# Altium schematic sheet PumpControl.SchDoc: Sample Sheet Title
size B; Date: MM/DD/YYYY; Author: Sample Author; Organization: ORGANIZATION; Address1: ADDRESS 1; Address2: ADDRESS 2; Address3: ADDRESS 3; Address4: ADDRESS 4; Revision: -; SheetNumber: 1; SheetTotal: 3; ENG_APP_DATE: --/--/--; DSN_APP_DATE: --/--/--; CHK_APP_DATE: --/--/--
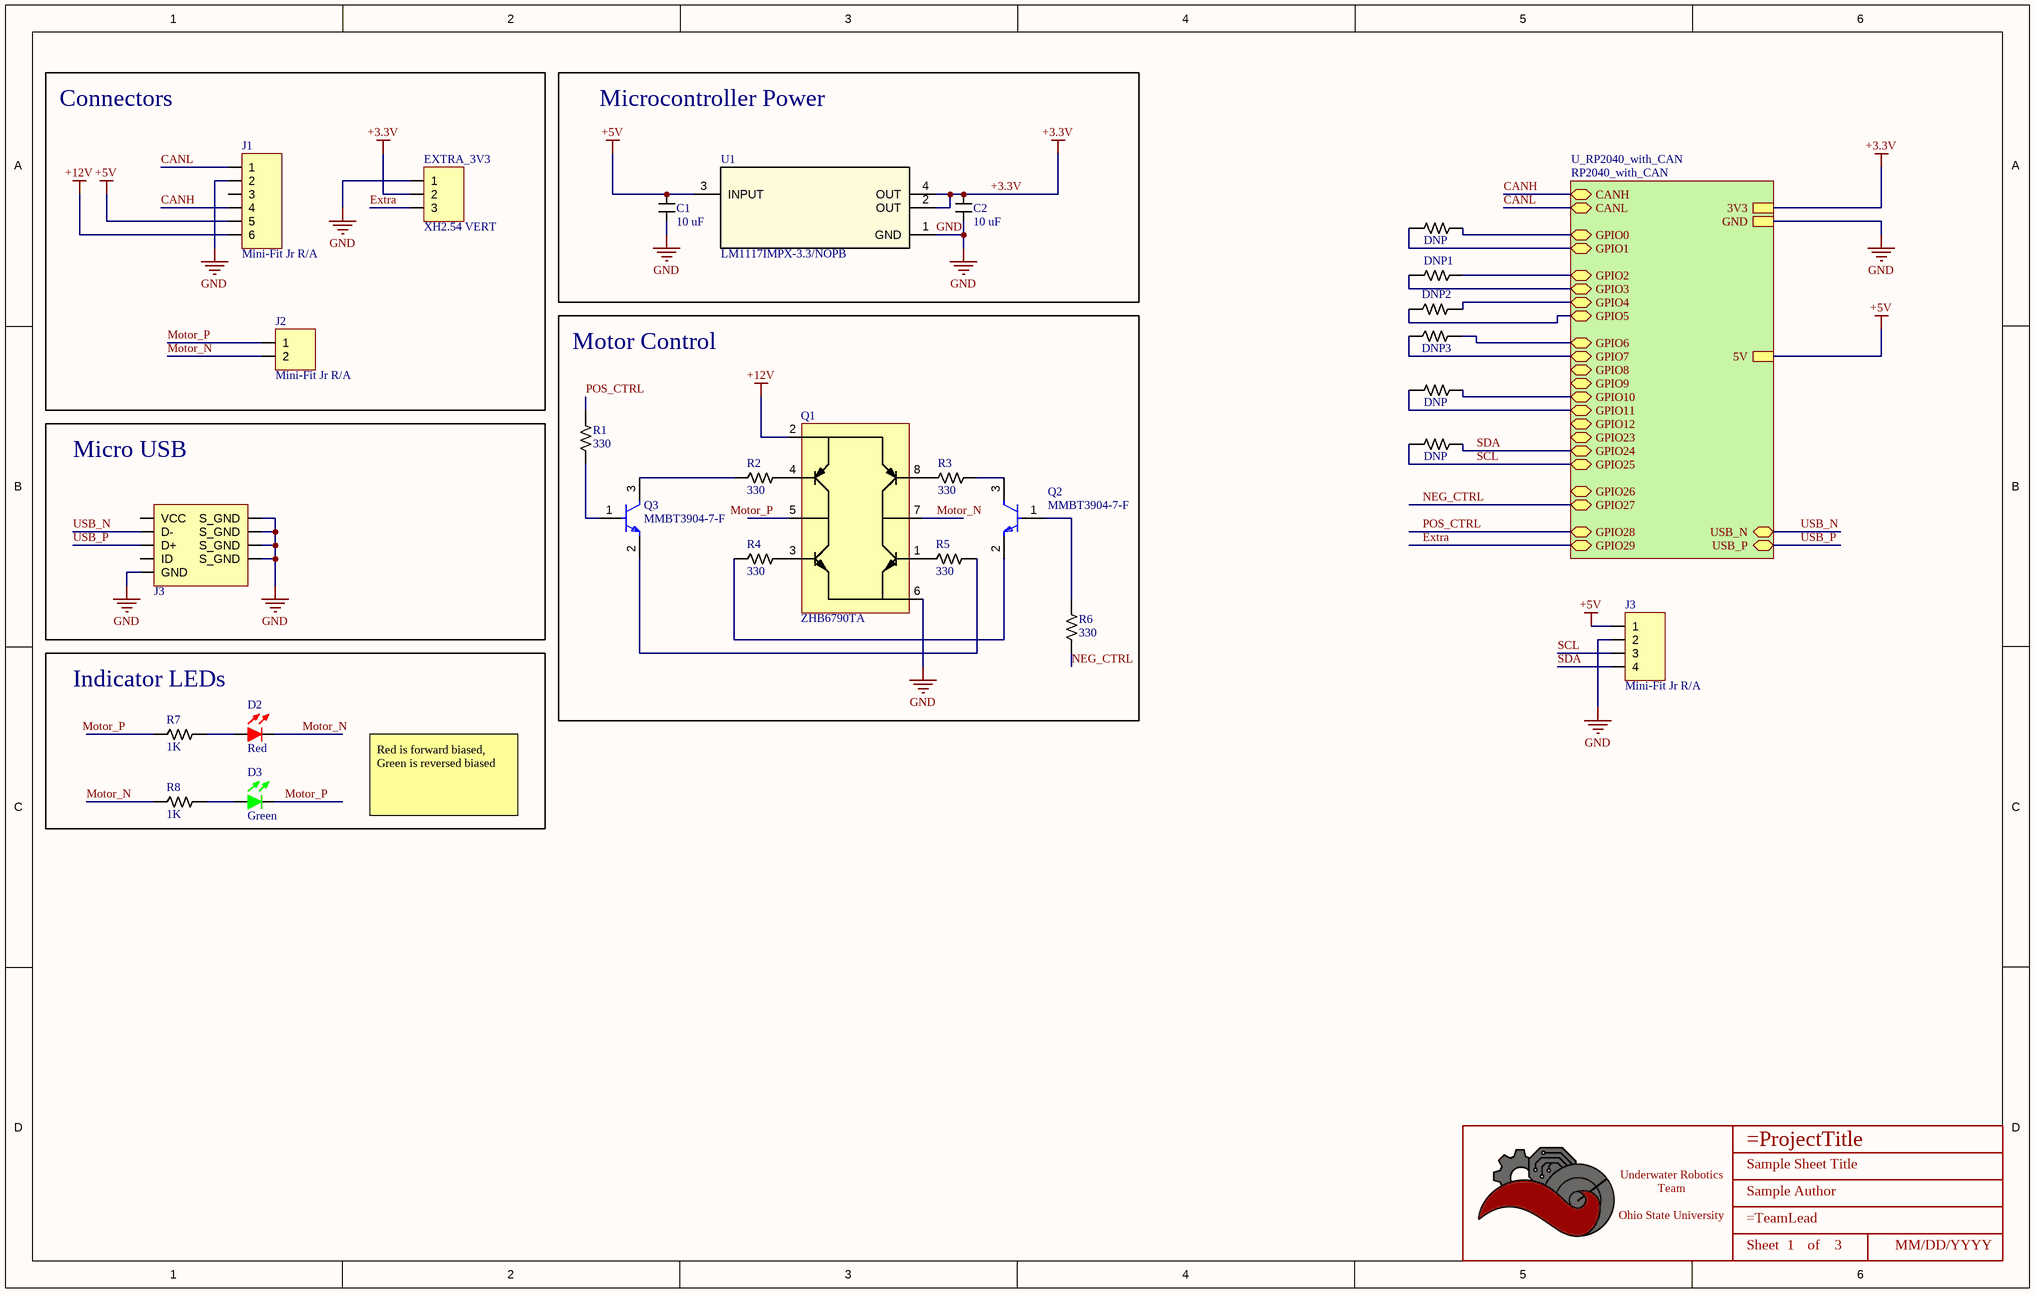
[diagram p0: PumpControl.SchDoc]

## Parts
(Parts that share a designator on the sheet are numbered #1, #2 ... from top to bottom, then left to right.)
*  Title_Block  [LOGO]  (value not drawn)  (graphical)
C1  Value (uF): 10 uF  [CAPACITOR_0603]  (hidden comment: 10uF Ceramic 6.3V)
C2  Value (uF): 10 uF  [CAPACITOR_0603]  (hidden comment: 10uF Ceramic 6.3V)
D2  Color: Red  [LED_0603]  (hidden comment: 150060RS75000)
D3  Color: Green  [LED_0603]  (hidden comment: IN-S63AT5G)
DNP1  DNP  [RESISTOR_0402]  (value not drawn)
DNP2  DNP  [RESISTOR_0402]  (value not drawn)
DNP3  DNP  [RESISTOR_0402]  (value not drawn)
DNP5  DNP  [RESISTOR_0402]
DNP7  DNP  [RESISTOR_0402]
DNP9  DNP  [RESISTOR_0402]
EXTRA_3V3  XH2.54 VERT  [CONN_JST_XH254_3POS_VERT]
J1  Mini-Fit Jr R/A  [CONN_MOLEX_MINIFIT JR_6 POS_R/A]
J2  Mini-Fit Jr R/A  [CONN_MOLEX_MINIFIT JR_2 POS_R/A]
J3#1  USB_MICRO R/A  [CONN_MINIUSB]  (value not drawn)
J3#2  Mini-Fit Jr R/A  [CONN_MOLEX_MINIFIT JR_4 POS_R/A]
Q1  ZHB6790TA  [SOT-223-8]
Q2  MMBT3904-7-F  [FP-SOT23-IPC_A]
Q3  MMBT3904-7-F  [FP-SOT23-IPC_A]
R1  Value  (Ohms): 330  [RESISTOR_0603]  (hidden comment: 330 Ohm 1% 1/10W)
R2  Value  (Ohms): 330  [RESISTOR_0603]  (hidden comment: 330 Ohm 1% 1/10W)
R3  Value  (Ohms): 330  [RESISTOR_0603]  (hidden comment: 330 Ohm 1% 1/10W)
R4  Value  (Ohms): 330  [RESISTOR_0603]  (hidden comment: 330 Ohm 1% 1/10W)
R5  Value  (Ohms): 330  [RESISTOR_0603]  (hidden comment: 330 Ohm 1% 1/10W)
R6  Value  (Ohms): 330  [RESISTOR_0603]  (hidden comment: 330 Ohm 1% 1/10W)
R7  Value  (Ohms): 1K  [RESISTOR_0603]  (hidden comment: 1k Ohm 5% 1/8W)
R8  Value  (Ohms): 1K  [RESISTOR_0603]  (hidden comment: 1k Ohm 5% 1/8W)
U1  LM1117IMPX-3.3/NOPB  [SOT-223-4]

## Blocks framed on the sheet
Connectors: EXTRA_3V3 J1 J2
Microcontroller Power: C1 C2 U1
Motor Control: Q1-Q3 R1-R6
Micro USB: J3#1
Indicator LEDs: D2 D3 R7 R8

## Sub-sheets
U_RP2040_with_CAN = RP2040_with_CAN: USB_P (bidir), USB_N (bidir), 5V, CANH (bidir), CANL (bidir), GPIO0 (bidir), GPIO1 (bidir), GPIO2 (bidir), GPIO3 (bidir), GPIO4 (bidir), GPIO5 (bidir), GPIO6 (bidir), GPIO7 (bidir), GPIO8 (bidir), GPIO9 (bidir), GPIO10 (bidir), GPIO11 (bidir), GPIO12 (bidir), GPIO23 (bidir), GPIO24 (bidir), GPIO25 (bidir), GPIO26 (bidir), GPIO27 (bidir), GPIO28 (bidir), GPIO29 (bidir), 3V3, GND

## Nets
+3.3V: C2.1 EXTRA_3V3.2 U1.2(OUT) U1.4(OUT) ; sheet U_RP2040_with_CAN/3V3
+5V: C1.1 J1.5 J3#2.1 U1.3(INPUT) ; sheet U_RP2040_with_CAN/5V
+12V: J1.6 Q1.2(E1,_E4)
GND: C1.2 C2.2 EXTRA_3V3.1 J1.2 J3#1.5(GND) J3#1.6(S_GND) J3#1.7(S_GND) J3#1.8(S_GND) J3#1.9(S_GND) J3#2.2 Q1.6(E2,_E3) U1.1(GND) ; sheet U_RP2040_with_CAN/GND
CANH: J1.4 ; sheet U_RP2040_with_CAN/CANH
CANL: J1.1 ; sheet U_RP2040_with_CAN/CANL
Extra: EXTRA_3V3.3 ; sheet U_RP2040_with_CAN/GPIO29
Motor_N: D2.2 J2.2 Q1.7(C3,_C4) R8.2
Motor_P: D3.2 J2.1 Q1.5(C1,_C2) R7.2
NEG_CTRL: R6.2 ; sheet U_RP2040_with_CAN/GPIO27
POS_CTRL: R1.1 ; sheet U_RP2040_with_CAN/GPIO28
SCL: DNP7.1 J3#2.3 ; sheet U_RP2040_with_CAN/GPIO25
SDA: DNP7.2 J3#2.4 ; sheet U_RP2040_with_CAN/GPIO24
USB_N: J3#1.2(D-) ; sheet U_RP2040_with_CAN/USB_N
USB_P: J3#1.3(D+) ; sheet U_RP2040_with_CAN/USB_P
NetD2_1: D2.1 R7.1
NetD3_1: D3.1 R8.1
NetDNP1_1: DNP1.1 ; sheet U_RP2040_with_CAN/GPIO3
NetDNP1_2: DNP1.2 ; sheet U_RP2040_with_CAN/GPIO2
NetDNP2_1: DNP2.1 ; sheet U_RP2040_with_CAN/GPIO4
NetDNP2_2: DNP2.2 ; sheet U_RP2040_with_CAN/GPIO5
NetDNP3_1: DNP3.1 ; sheet U_RP2040_with_CAN/GPIO6
NetDNP3_2: DNP3.2 ; sheet U_RP2040_with_CAN/GPIO7
NetDNP5_1: DNP5.1 ; sheet U_RP2040_with_CAN/GPIO11
NetDNP5_2: DNP5.2 ; sheet U_RP2040_with_CAN/GPIO10
NetDNP9_1: DNP9.1 ; sheet U_RP2040_with_CAN/GPIO1
NetDNP9_2: DNP9.2 ; sheet U_RP2040_with_CAN/GPIO0
NetQ1_1: Q1.1(B3) R5.2
NetQ1_3: Q1.3(B2) R4.1
NetQ1_4: Q1.4(B1) R2.1
NetQ1_8: Q1.8(B4) R3.1
NetQ2_1: Q2.1(B) R6.1
NetQ2_2: Q2.2(E) R4.2
NetQ2_3: Q2.3(C) R3.2
NetQ3_1: Q3.1(B) R1.2
NetQ3_2: Q3.2(E) R5.1
NetQ3_3: Q3.3(C) R2.2

Not connected (* = marked no-connect by the designer): J1 3; J3#1 1(VCC) 4(ID)

## Notes on the sheet
- Red is forward biased, Green is reversed biased
- DWG. NO.
- REV.
- SHT.
- THIS DOCUMENT AND THE DATA DISCLOSED HEREIN OR HEREWITH IS THE PROPERTY OF ALTIUM LIMITED AND MAY BE FREELY DISTRIBUTED IN WHOLE. NO RIGHTS ARE RESERVED OR EXPRESS OR IMPLIED WARANTEE GIVEN.
- REVISION
- DESCRIPTION
- DATE
- APPROVED
- ENG:
- APPROVALS
- PROJECT
- DSN:
- CHK:
- REFERENCE DOCUMENTS
- PROJECT REVISION:
- TITLE
- DOCUMENT REVISION:
- DESIGN ITEM:
- BOM:
- FAB DWG:
- PCB DWG:
- ASSY DWG:
- SCALE:
- SIZE
- B
- CAGE CODE
- FILE NAME
- DWG NO.
- SHEET
- OF
- REV
- (in symbol Title_Block) Underwater Robotics Team / Ohio State University; Sheet; of

## Library data of the parts
* = Title_Block: UWRT Schematic Title Block Template / Created June 2021, Dylan Trainor
C1 C2 = CAPACITOR_10uF_0603: Cap 10uF 6.3V +/-20% / Ceramic 0603; Made By: Flip B; ComponentLink1Description: Digikey; ComponentLink1URL: https://www.digikey.com/en/products/detail/samsung-electro-mechanics/CL10A106MQ8NNNC/3886777; Supplier 1: Digi-Key; Supplier Part Number 1: 1276-1119-1-ND; Tolerance: +/- 20%; Voltage: 6.3V
D2 = LED_Red_0603: LED Red Vf= 2V If = 0.020A / 150060RS75000; Made By: Robert Pafford; Forward Current: 20mA; Forward Voltage: 2V; Package: 0603; Supplier 1: Digi-Key; Supplier Part Number 1: 732-4978-1-ND
D3 = LED_Green_0603_3V: LED Green Vf= 3V If = 0.005A / IN-S63AT5G; Made By: Robert Pafford; Forward Current: 5mA; ComponentLink1Description: Datasheet; ComponentLink1URL: https://www.we-online.de/katalog/datasheet/150060GS75000.pdf; Forward Voltage: 3V; Package: 0603; Supplier 1: Digi-Key; Supplier Part Number 1: 1830-1062-1-ND
DNP1-DNP3 DNP5 DNP7 DNP9 = DNP_0402: Do Not Populate 0402
EXTRA_3V3 = CONN_JST_XH254_3POS_VERT: JST XH 2.54mm Pitch 3 Pos Vertical; Current Per Pin: 4A; Number of Positions: 3; NOTE: Do not use JST 2.5mm parts with this footprint. JST does not make 2.54mm pitch pins, rather only clones make this connector!; Manufacturer: JST; Pitch: 2.54mm; Configuration: Vertical; Color: White; Created By: Robert P; Series: XH 2.54; ComponentLink1Description: Purchase Link; ComponentLink1URL: https://www.amazon.com/460PCS-XH2-54-Connector-Terminal-Connectors/dp/B09DBGVX5C
J1 = CONN_MOLEX_MINIFIT JR_6POS_R/A: Molex Minifit Jr. 5569 / 6 Pos R/A Natural; Pitch: 4.2mm; Configuration: Right Angle; Current Per Pin: 13A; Number of Positions: 8; Manufacturer: Molex; Color: Natural; Created By: Flip B; ComponentLink1Description: Datasheet; ComponentLink1URL: https://www.molex.com/pdm_docs/ps/PS-5556-001.pdf; Series: Minifit Jr 5569; Supplier 1: Digi-Key; Supplier Part Number 1: WM1353-ND
J2 = CONN_MOLEX_MINIFIT JR_2POS_R/A: Molex Minifit Jr. 5569 / 2 Pos R/A Natural; Pitch: 4.2mm; Configuration: Right Angle; Current Per Pin: 13A; Number of Positions: 2; Manufacturer: Molex; Color: Natural; Created By: Robert P; ComponentLink1Description: Datasheet; ComponentLink1URL: https://www.molex.com/pdm_docs/sd/026013115_sd.pdf; Series: Minifit Jr 5569; Supplier 1: Digi-Key; Supplier Part Number 1: WM1351-ND
J3#1 = CONN_MICROUSB: Amphenol Micro USB-B / USB2.0 5 Pin Right Angle SMD; Pitch: 0.65mm; Current Per Pin: 1.8A; Number of Positions: 5; Manufacturer: Amphenol; Configuration: Right Angle; Color: Silver; Created By: Flip B; ComponentLink1Description: Datasheet; ComponentLink1URL: https://cdn.amphenol-icc.com/media/wysiwyg/files/documentation/datasheet/inputoutput/io_usb_micro.pdf?__cf_chl_jschl_tk__=05693735e19256298f6ef6ca2bb2e65c376a4f56-1625503833-0-Abitsb0-ufjOXJYs_S3J3r2iTn-nObalbmXUksF1VvO_h_WEmRdMlUD1I8-hmWSEVWzY1pirKnrPZWfgY3851qyBZe5ZvnNQePLGIzUgdEIQBVUyW36RsbYpDLEWxJ4horD-5gChFgobLYqwmG5aHl0E8lIn_twwPPrOxilK2gP0q9t_CNOs_u5fMqXvXUrlsOv8tIE2NRlu6NVP8qtkL2GjhlkeTUbDMF8WvvpPDTFOgvZ4Y16Ej8F8AhWos88mo5B1HssXozw0XrkJQIqERITUu6rqloz9kf4ZzhBHtDAt-IkiAFY_Ds9SW8FYKKTtINJVpHZQ6Gyu1FFM4Dc9MO0maE8_mmNcwlxqyRoRk_MPWW8VyByXWM5RSp52jteRKw7FeI9WIYvCbPAOy0Eyib-aseIQsnGbglBcUY6_2xp8GYaJM38H3dNvBPsSOfJBPndKedwKHllxjkucXn6xsN0sDXkpGN-cu8_2bDTJ0g-uUucKSCooYX-ApSDNGpkA_p9zv1SOAD8c0zaZVmtiBsN75QpVz2rzq9_BFxOywPvR; Series: 10118192; Supplier 1: Digi-Key; Supplier Part Number 1: 609-4613-1-ND
J3#2 = CONN_MOLEX_MINIFIT JR_4POS_R/A: Molex Minifit Jr. 5569 / 4 Pos R/A Natural; Pitch: 4.2mm; Configuration: Right Angle; Current Per Pin: 13A; Number of Positions: 4; Supplier Part Number 1: WM13112-ND; Supplier 1: Digi-Key; Manufacturer: Molex; Color: Natural; Created By: Flip B; ComponentLink1Description: Datasheet; ComponentLink1URL: https://www.molex.com/pdm_docs/sd/026013115_sd.pdf; Series: Minifit Jr 5569
Q1 = ZHB6790TA: TRANS 2NPN/2PNP 40V 2A SM8; Voltage - CE Breakdown: 40V; Supplier 1: Digikey; Supplier Part Number 1: ZHB6790CT-ND; Current - Collector (IC) (Max): 2A; Package: SOT-223-8
Q2 Q3 = CMP-2000-04931-2: TRANS NPN 40V 0.2A SMD SOT23-3; Frequency: 300MHz; Power Dissipation: 350mW; Element Configuration: Single; Max Power Dissipation: 300mW; Max Collector Current: 200mA; Collector Emitter Saturation Voltage: 300mV; Number of Elements: 1; hFE Min: 100; Collector Base Voltage (VCBO): 60V; Emitter Base Voltage (VEBO): 6V; Contact Plating: Tin; Package Quantity: 3000; Max Frequency: 300MHz; REACH SVHC: No SVHC; Max Operating Temperature: 150°C; Width: 1.4mm; Collector Emitter Voltage (VCEO): 40V; Voltage Rating (DC): 40V; Radiation Hardening: No; Case/Package: SOT-23; Height: 1mm; Collector Emitter Breakdown Voltage: 40V; Length: 3.05mm; Polarity: NPN; Packaging: Tape and Reel; Number of Pins: 3; Min Operating Temperature: -55°C; Gain Bandwidth Product: 300MHz; Mount: Surface Mount; Weight: 0.000282oz; Continuous Collector Current: 200mA; Transition Frequency: 300MHz; Max Breakdown Voltage: 40V; Lead Free: Lead Free
R1-R6 = RESISTOR_330_0603: RES 330 OHM 1% 1/10W 0603; Tolerance: +/- 1%; Made By: Robert Pafford; Wattage: 1/10W; Supplier 1: Digi-Key; Supplier Part Number 1: P330HCT-ND
R7 R8 = RESISTOR_1K_0603: RES 1k OHM 5% 1/8W 0603; Tolerance: +/- 5%; Made By: Robert Pafford; ComponentLink1Description: Datasheet; ComponentLink1URL: https://www.bourns.com/docs/product-datasheets/CRxxxxx.pdf; Wattage: 1/8W; Supplier: Digikey; Digikey Part Numer: CR0603-JW-104ELFTR-ND; Supplier 1: Digi-Key; Supplier Part Number 1: 2019-RK73B1JTTD102JCT-ND
U1 = LM1117IMPX-3.3/NOPB: IC REG LIN 3.3V 800MA SOT223-4; PartNumber: LM1117IMP-3.3/NOPB; Manufacturer: Texas Instruments; Vin (Max): 15V; Supplier 1: Digi-Key; Supplier Part Number 1: LM1117IMPX-3.3/NOPBCT-ND; Vout (Min/Fixed): 3.3V; Amp Out: 800mA; Package: SOT-223-4; Created By: Dylan T